# Altium schematic sheet Channel Fix (OPEN COLLECTOR).SchDoc
size A4
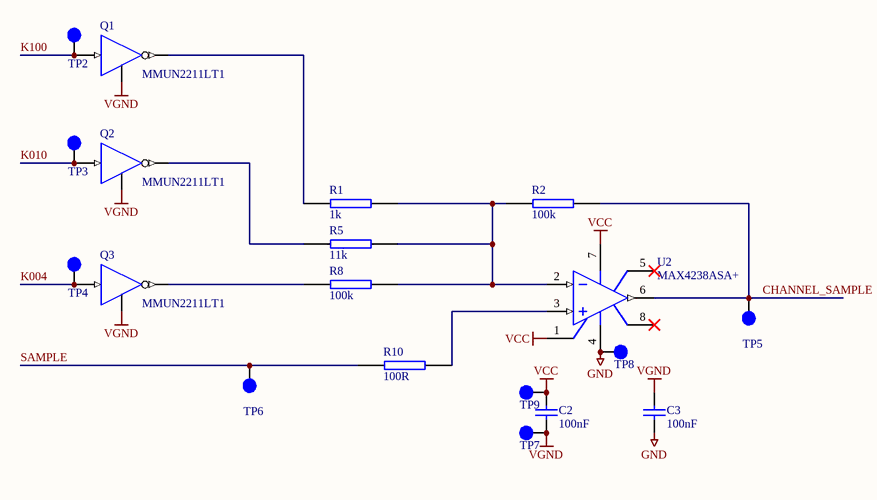
[diagram p0: Channel Fix (OPEN COLLECTOR).SchDoc]

## Parts
C2  100nF  [CAP (3D) - 0805]
C3  100nF  [CAP (3D) - 0805]
Q1  MMUN2211LT1  [SOT23-3L]
Q2  MMUN2211LT1  [SOT23-3L]
Q3  MMUN2211LT1  [SOT23-3L]
R1  1k  [RES (3D) - 0805]
R2  100k  [RES (3D) - 0805]
R5  11k  [RES (3D) - 0805]
R8  100k  [RES (3D) - 0805]
R10  100R  [RES (3D) - 0805]
TP2  TestPoint  [TP]  (value not drawn)
TP3  TestPoint  [TP]  (value not drawn)
TP4  TestPoint  [TP]  (value not drawn)
TP5  TestPoint  [TP]  (value not drawn)
TP6  TestPoint  [TP]  (value not drawn)
TP7  TestPoint  [TP]  (value not drawn)
TP8  TestPoint  [TP]  (value not drawn)
TP9  TestPoint  [TP]  (value not drawn)
U2  MAX4238ASA+  [SO-8]

## Nets
GND: C3.1 TP8.1 U2.4(VEE)
VCC: C2.2 TP9.1 U2.1(NULL) U2.7(VCC)
VGND: C2.1 C3.2 Q1.2(E) Q2.2(E) Q3.2(E) TP7.1
CHANNEL_SAMPLE: R2.2 TP5.1 U2.6(OUT)
K004: Q3.1(B) TP4.1
K010: Q2.1(B) TP3.1
K100: Q1.1(B) TP2.1
SAMPLE: R10.1 TP6.1
NetQ1_3: Q1.3(C) R1.1
NetQ2_3: Q2.3(C) R5.1
NetQ3_3: Q3.3(C) R8.1
NetR1_2: R1.2 R2.1 R5.2 R8.2 U2.2(IN-)
NetR10_2: R10.2 U2.3(IN+)

Not connected (* = marked no-connect by the designer): U2 5(NULL)* 8(NC)*

## Library data of the parts
C2 C3 = Cap: Capacitor; Value: 100nF; Supplier 1: Mouser; Supplier 2: Digi-Key; Supplier Part Number 1: 603-C0603ZRY5V9BB104; Supplier Part Number 2: 311-1343-2-ND
Q1-Q3 = MMUN221LT1 NPN DIGITAL TRANSISTOR: Manufacturer: ON Semiconductor; Manufacturer Part No.: MMUN2211LT1G; Mouser Part no.: 863-MMUN2211LT1G; Farnell Part no.: 9556648RL; Web link: http://au.mouser.com/ProductDetail/ON-Semiconductor/MMUN2211LT1G/?qs=sGAEpiMZZMt32xmUYxteeYvHZcSNQKJZCO%252bIh%252bS%252bXZs%3d
R1 R2 R5 R8 R10 = RES SMD 0603: RESISTOR SMD 0603
  R1: value: 1k
  R2 R8: value: 100k
  R5: value: 11k
  R10: value: 100R
U2 = MAX495CSA: Single Voltage-Feedback Operational Amplifier; Published: 23-Sep-2002; LatestRevisionDate: 13-Apr-2006; LatestRevisionNote: IPC-7351 Footprint Added.; DatasheetVersion: Rev 2; 9/96; PackageReference: NSO8; Publisher: Altium Limited; PackageDescription: 8-Pin Small Outline Integrated Circuit 1.27 mm Pitch; Code_JEDEC: MS-012-AA; Code_IPC: SOIC127P600-8; ComponentLink1Description: Manufacturer Link; ComponentLink1URL: http://www.maxim-ic.com/; ComponentLink2Description: Datasheet; ComponentLink2URL: http://pdfserv.maxim-ic.com/en/ds/MAX492-MAX495.pdf